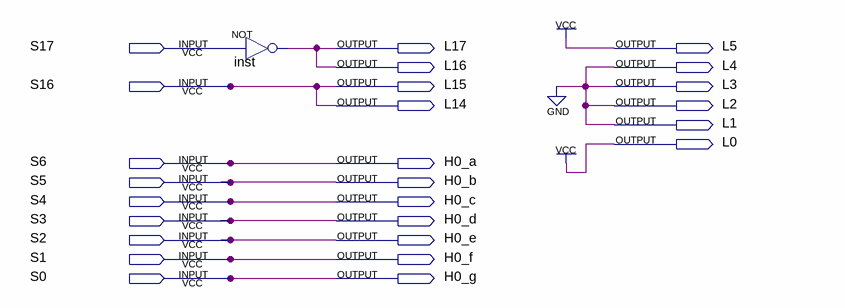
[diagram p0: schematic sheet]
// Quartus schematic 01_dip_switch_quartus.bdf as structural Verilog: 1 symbols, 26 pins
module \01_dip_switch_quartus  (
  input  S17,
  input  S16,
  input  S6,
  input  S5,
  input  S4,
  input  S3,
  input  S2,
  input  S1,
  input  S0,
  output L17,
  output L5,
  output L16,
  output L4,
  output L15,
  output L3,
  output L14,
  output L2,
  output L1,
  output L0,
  output H0_a,
  output H0_b,
  output H0_c,
  output H0_d,
  output H0_e,
  output H0_f,
  output H0_g
);

  not inst (L16, S17);

  assign H0_a = S6;
  assign H0_b = S5;
  assign H0_c = S4;
  assign H0_d = S3;
  assign H0_e = S2;
  assign H0_f = S1;
  assign H0_g = S0;
  assign L0 = 1'b1;
  assign L1 = 1'b0;
  assign L2 = 1'b0;
  assign L3 = 1'b0;
  assign L4 = 1'b0;
  assign L5 = 1'b1;
  assign L14 = S16;
  assign L15 = S16;
  assign L17 = L16;
endmodule
